# Altium schematic sheet fan_ctrl.SchDoc
size A3; SheetNumber: 2; SheetTotal: 5
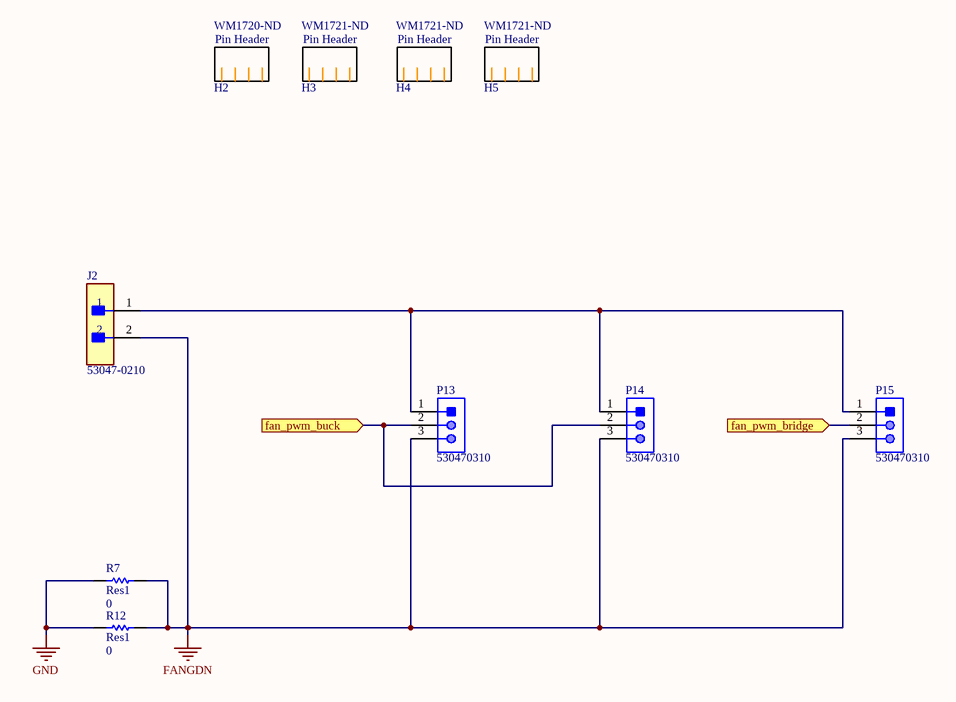
[diagram p0: fan_ctrl.SchDoc]

## Parts
H2  Supplier Part Number 1: WM1720-ND  (hidden comment: Generic Pin  Header)
H3  Supplier Part Number 1: WM1721-ND  (hidden comment: Generic Pin  Header)
H4  Supplier Part Number 1: WM1721-ND  (hidden comment: Generic Pin  Header)
H5  Supplier Part Number 1: WM1721-ND  (hidden comment: Generic Pin  Header)
J2  53047-0210  [FP-53047-0210-MFG]
P13  530470310  [MOLX-530470310_V]
P14  530470310  [MOLX-530470310_V]
P15  530470310  [MOLX-530470310_V]
R7  Res1  value 0  [RES 0603_1608]
R12  Res1  value 0  [RES 0603_1608]

## Ports
fan_pwm_bridge (in), fan_pwm_buck (in)

## Nets
FANGDN: J2.2 P13.3 P14.3 P15.3 R7.2 R12.2
GND: R7.1 R12.1
fan_pwm_bridge: P15.2 ; port fan_pwm_bridge
fan_pwm_buck: P13.2 P14.2 ; port fan_pwm_buck
NetJ2_1: J2.1 P13.1 P14.1 P15.1

## Notes on the sheet
- 1
- 2
- 3
- 4
- 5
- 6
- 7
- 8
- A
- B
- C
- D
- Project:
- Date:
- Drawing number:
- Rev:
- Format:
- A3
- Drawn by:
- Laboratory:
- Page
- Sheet:
- of
- File:
- (in symbol generic_pin_header) Pin Header

## Library data of the parts
H2-H5 = generic_pin_header: Assign Supplier Link Manually; Supplier 1: Digi-Key
J2 = CMP-2000-05628-3: CONN HEADER VERT 2POS 1.25MM; Manufacturer: Molex; Conn Gender: Male; Voltage Rating: 125V; Conn Orientation: Vertical; Number Of Contacts: 2; Current Rating: 1A; Contact Material: Tin; Temperature Range Low: -40°C; ComponentLink2URL: http://www.molex.com/webdocs/datasheets/pdf/en-us/0530470210_PCB_HEADERS.pdf; Mouser Description: 1.25mm Pitch PicoBlade™ Wire-to-Board Header, Vertical, with Friction Lock, 2 Circuits; Manufacturer Part Number: 53047-0210; Temperature Range High: +85°C; ComponentLink2Description: Datasheet; Automotive: No; RoHS: TRUE; Ambient Temperature Range High: +85°C; Octopart: https://octopart.com/53047-0210-molex-276772; Footprint Url: https://www.molex.com/pdm_docs/sd/530470210_sd.pdf; Lead Free: Yes; Pitch: 1.25mm; Temperature: -40°C to +85°C; Device Class L2: Headers and Wire Housings; Package: 0; Ambient Temperature Range Low: -40°C; Digikey Description: CONN HEADER VERT 2POS 1.25MM; Category: Conn; Device Class L3: unset; Number Of Rows: 1; Device Class L1: Connectors; Height: 4.4mm
P13-P15 = CMP-2000-05465-1: Male Header, Pitch 1.25 mm, 1 x 3 Position, Height 4.2 mm, Tail Length 2.3 mm, -40 to 85 degC, RoHS, Tray; Manufacturer: Molex; Datasheet Version: Rev. E, 11/1994; Mounting Technology: ThroughHole; Package Reference: 530470310; Datasheet URL: http://www.molex.com/pdm_docs/sd/530470310_sd.pdf; Package Description: Male Header, Pitch 1.25 mm, 1 x 3 Position, Height 4.2 mm, Tail Length 2.3 mm; Manufacturer URL: http://www.molex.com/
R7 R12 = Res1: Resistor; Published: 8-Jun-2000; LatestRevisionDate: 17-Jul-2002; LatestRevisionNote: Re-released for DXP Platform.; PackageReference: AXIAL-0.3; Publisher: Altium Limited; PackageDescription: Axial Device, Thru-Hole; 2 Leads; 0.3 in Pin Spacing